# EAGLE schematic controller_v6 (EAGLE 7.1.0)

## Sheet 1 of 4
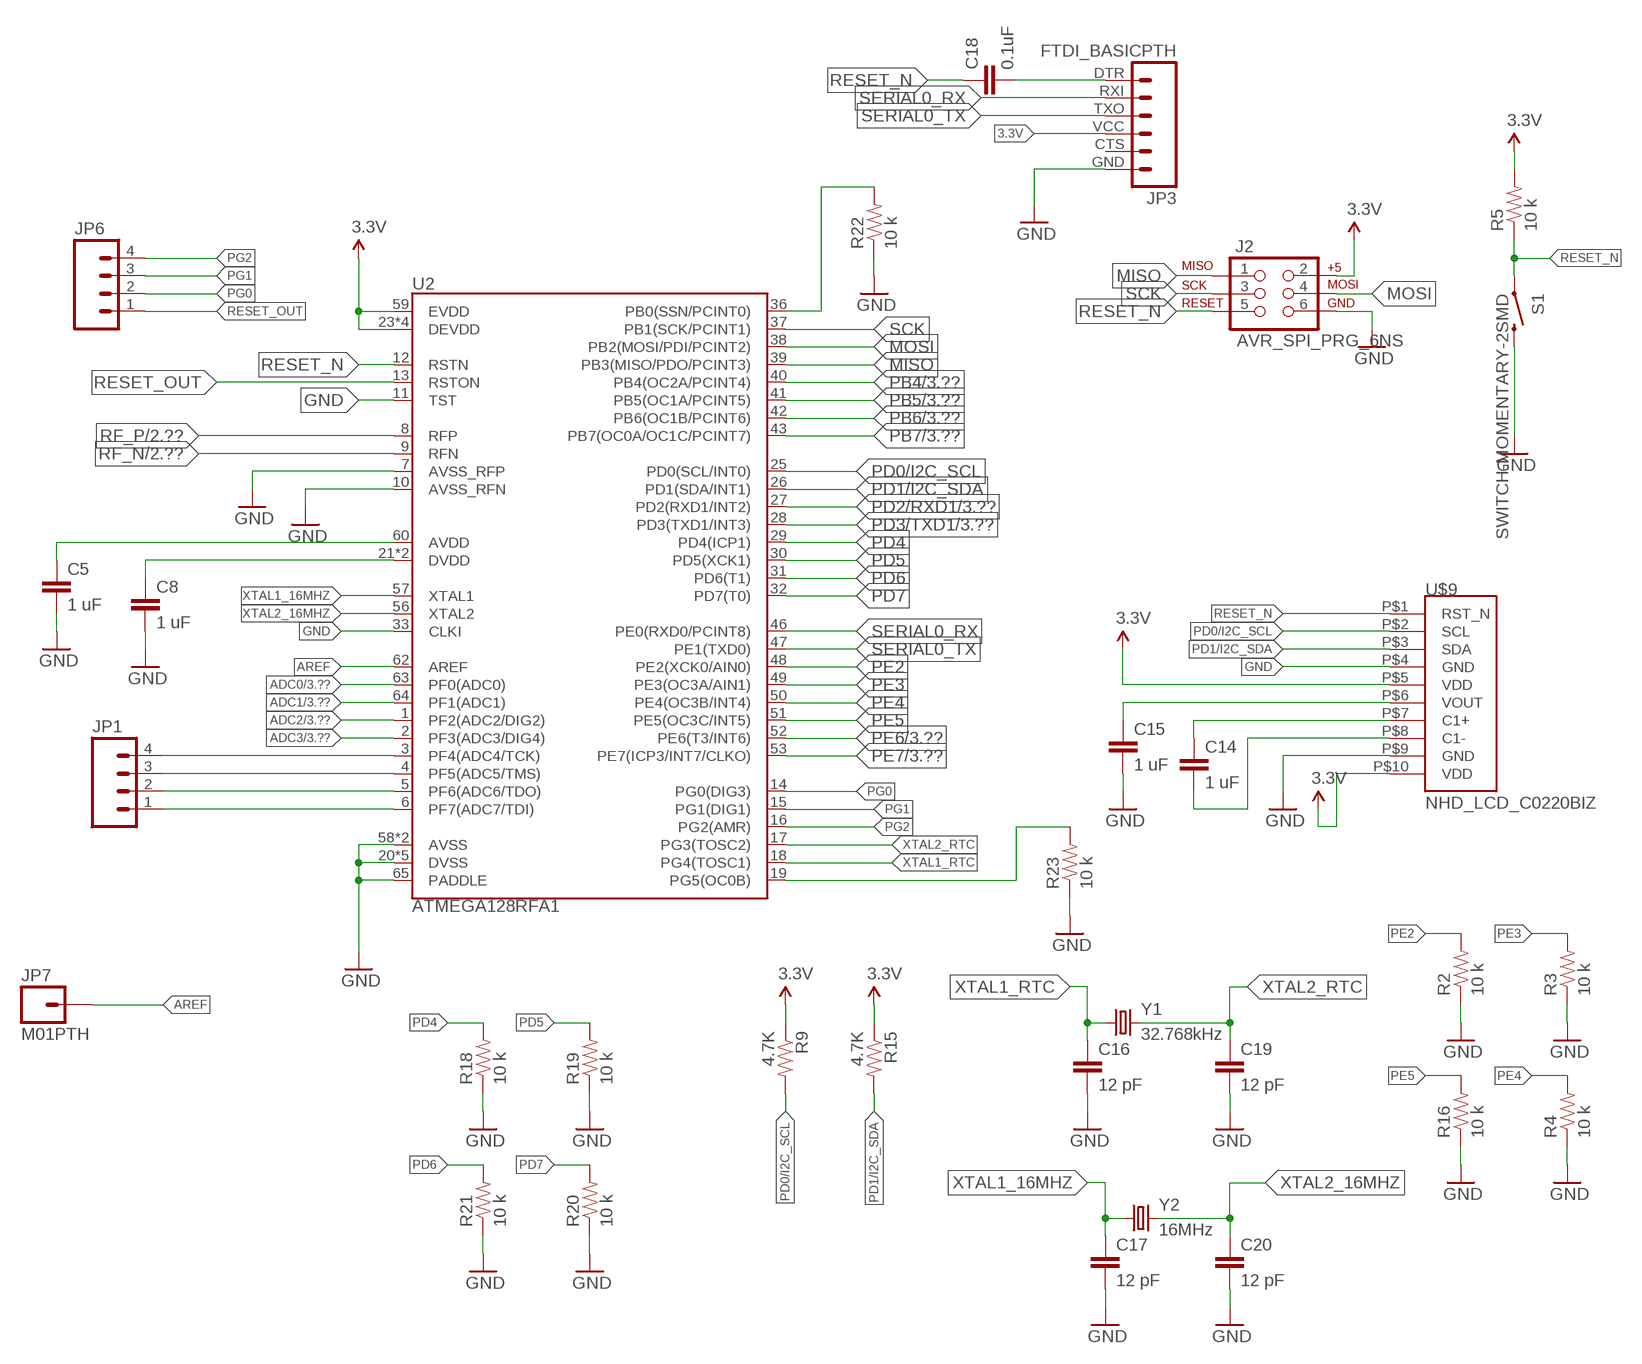
[diagram p0: schematic, sheet 1]

### Parts
C5  1 uF  CAP0805  [0805]
C8  1 uF  CAP0805  [0805]
C14  1 uF  CAP0805  [0805]
C15  1 uF  CAP0805  [0805]
C16  12 pF  CAP0805  [0805]
C17  12 pF  CAP0805  [0805]
C18  0.1uF  CAP0805  [0805]
C19  12 pF  CAP0805  [0805]
C20  12 pF  CAP0805  [0805]
J2  AVR_SPI_PRG_6NS  [2X3-NS]
JP1  M04PTH  [1X04]
JP3  FTDI_BASICPTH  [FTDI_BASIC]
JP6  M04PTH  [1X04]
JP7  M01PTH  [1X01]
R2  10 k  RESISTOR0805-RES  [0805]
R3  10 k  RESISTOR0805-RES  [0805]
R4  10 k  RESISTOR0805-RES  [0805]
R5  10 k  RESISTOR0805-RES  [0805]
R9  4.7K  RESISTOR0805-RES  [0805]
R15  4.7K  RESISTOR0805-RES  [0805]
R16  10 k  RESISTOR0805-RES  [0805]
R18  10 k  RESISTOR0805-RES  [0805]
R19  10 k  RESISTOR0805-RES  [0805]
R20  10 k  RESISTOR0805-RES  [0805]
R21  10 k  RESISTOR0805-RES  [0805]
R22  10 k  RESISTOR0805-RES  [0805]
R23  10 k  RESISTOR0805-RES  [0805]
S1  SWITCH-MOMENTARY-2SMD  [TACTILE_SWITCH_SMD]
U2  ATMEGA128RFA1  [QFN-64]
U$9  NHD_LCD_C0220BIZ  [1X08-2MMPTH-LCD]
Y1  32.768kHz  CRYSTAL32-SMD  [CRYSTAL-32KHZ-SMD]
Y2  16MHz  CRYSTAL5X3  [CRYSTAL-SMD-5X3]

### Nets
3.3V: J2.2 JP3.VCC R5.2 R9.1 R15.1 U2.23(DEVDD) U2.34(DEVDD) U2.44(DEVDD) U2.54(DEVDD) U2.59(EVDD) U$9.P$5(VDD) U$9.P$10(VDD) ; also sheet 3,4
ADC0: U2.63(PF0(ADC0)) ; also sheet 3
ADC1: U2.64(PF1(ADC1)) ; also sheet 3
ADC2: U2.1(PF2(ADC2/DIG2)) ; also sheet 3
ADC3: U2.2(PF3(ADC3/DIG4)) ; also sheet 3
ADC4: JP1.4 U2.3(PF4(ADC4/TCK))
ADC5: JP1.3 U2.4(PF5(ADC5/TMS))
ADC6: JP1.2 U2.5(PF6(ADC6/TDO))
ADC7: JP1.1 U2.6(PF7(ADC7/TDI))
AREF: JP7.1 U2.62(AREF)
GND: C5.2 C8.2 C15.2 C16.2 C17.2 C19.2 C20.2 J2.6 JP3.GND R2.1 R3.1 R4.1 R16.1 R18.1 R19.1 R20.1 R21.1 R22.1 R23.1 S1.3 U2.7(AVSS_RFP) U2.10(AVSS_RFN) U2.11(TST) U2.20(DVSS) U2.24(DVSS) U2.33(CLKI) U2.35(DVSS) U2.45(DVSS) U2.55(DVSS) U2.58(AVSS) U2.61(AVSS) U2.65(PADDLE) U$9.P$4(GND) U$9.P$9(GND) ; also sheet 2,3,4
MISO: J2.1 U2.39(PB3(MISO/PDO/PCINT3))
MOSI: J2.4 U2.38(PB2(MOSI/PDI/PCINT2))
N$2: C18.2 JP3.DTR
N$5: C14.1 U$9.P$7(C1+)
N$15: C5.1 U2.60(AVDD)
N$16: C8.1 U2.21(DVDD) U2.22(DVDD)
N$22: C14.2 U$9.P$8(C1-)
PB0: R22.2 U2.36(PB0(SSN/PCINT0))
PB1: R23.2 U2.19(PG5(OC0B))
PB4: U2.40(PB4(OC2A/PCINT4)) ; also sheet 3
PB5: U2.41(PB5(OC1A/PCINT5)) ; also sheet 3
PB6: U2.42(PB6(OC1B/PCINT6)) ; also sheet 3
PB7: U2.43(PB7(OC0A/OC1C/PCINT7)) ; also sheet 3
PD0/I2C_SCL: R9.2 U2.25(PD0(SCL/INT0)) U$9.P$2(SCL)
PD1/I2C_SDA: R15.2 U2.26(PD1(SDA/INT1)) U$9.P$3(SDA)
PD2/RXD1: U2.27(PD2(RXD1/INT2)) ; also sheet 3
PD3/TXD1: U2.28(PD3(TXD1/INT3)) ; also sheet 3
PD4: R18.2 U2.29(PD4(ICP1))
PD5: R19.2 U2.30(PD5(XCK1))
PD6: R21.2 U2.31(PD6(T1))
PD7: R20.2 U2.32(PD7(T0))
PE2: R2.2 U2.48(PE2(XCK0/AIN0))
PE3: R3.2 U2.49(PE3(OC3A/AIN1))
PE4: R4.2 U2.50(PE4(OC3B/INT4))
PE5: R16.2 U2.51(PE5(OC3C/INT5))
PE6: U2.52(PE6(T3/INT6)) ; also sheet 3
PE7: U2.53(PE7(ICP3/INT7/CLKO)) ; also sheet 3
PG0: JP6.2 U2.14(PG0(DIG3))
PG1: JP6.3 U2.15(PG1(DIG1))
PG2: JP6.4 U2.16(PG2(AMR))
RESET_N: C18.1 J2.5 R5.1 S1.1 U2.12(RSTN) U$9.P$1(RST_N)
RESET_OUT: JP6.1 U2.13(RSTON)
RF_N: U2.9(RFN) ; also sheet 2
RF_P: U2.8(RFP) ; also sheet 2
SCK: J2.3 U2.37(PB1(SCK/PCINT1))
SERIAL0_RX: JP3.RXI U2.46(PE0(RXD0/PCINT8))
SERIAL0_TX: JP3.TXO U2.47(PE1(TXD0))
VOUT: C15.1 U$9.P$6(VOUT)
XTAL1_16MHZ: C17.1 U2.57(XTAL1) Y2.1
XTAL1_RTC: C16.1 U2.18(PG4(TOSC1)) Y1.X1
XTAL2_16MHZ: C20.1 U2.56(XTAL2) Y2.3
XTAL2_RTC: C19.1 U2.17(PG3(TOSC2)) Y1.X2
Unconnected: JP3.CTS

## Sheet 2 of 4
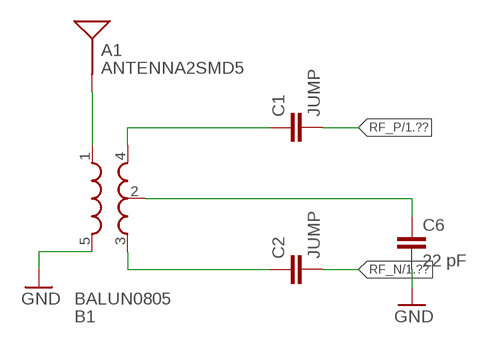
[diagram p1: schematic, sheet 2]

### Parts
A1  ANTENNA2SMD5  [ANTENNA-CHIP5]
B1  BALUN0805  [BALUN]
C1  JUMP  CAP0805  [0805]
C2  JUMP  CAP0805  [0805]
C6  22 pF  CAP0805  [0805]

### Nets
GND: B1.5(GND) C6.2 ; also sheet 1,3,4
N$9: B1.4(OUT1) C1.1
N$10: B1.3(OUT2) C2.1
N$11: B1.2(GND) C6.1
N$12: A1.FEED(SIGNAL) B1.1(IN)
RF_N: C2.2 ; also sheet 1
RF_P: C1.2 ; also sheet 1

## Sheet 3 of 4
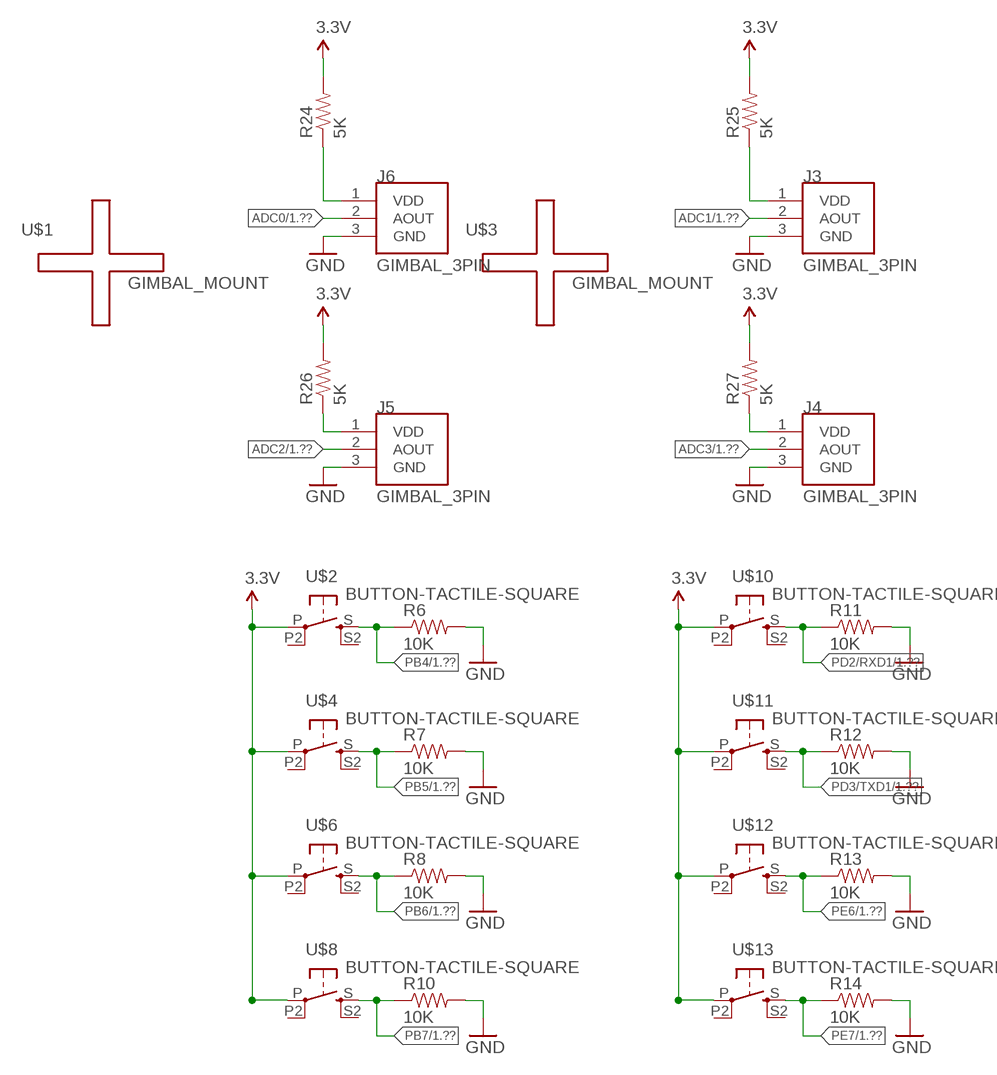
[diagram p2: schematic, sheet 3]

### Parts
J3  GIMBAL_3PIN  [JST-3-PTH]
J4  GIMBAL_3PIN  [JST-3-PTH]
J5  GIMBAL_3PIN  [JST-3-PTH]
J6  GIMBAL_3PIN  [JST-3-PTH]
R6  10K  RESISTOR0805-RES  [0805]
R7  10K  RESISTOR0805-RES  [0805]
R8  10K  RESISTOR0805-RES  [0805]
R10  10K  RESISTOR0805-RES  [0805]
R11  10K  RESISTOR0805-RES  [0805]
R12  10K  RESISTOR0805-RES  [0805]
R13  10K  RESISTOR0805-RES  [0805]
R14  10K  RESISTOR0805-RES  [0805]
R24  5K  RESISTOR0805-RES  [0805]
R25  5K  RESISTOR0805-RES  [0805]
R26  5K  RESISTOR0805-RES  [0805]
R27  5K  RESISTOR0805-RES  [0805]
U$1  GIMBAL_MOUNT  [GIMBAL_FOOTPRINT]
U$2  BUTTON-TACTILE-SQUARE  [BUTTON-TACTILE-SQUARE-ADAFRUIT1010]
U$3  GIMBAL_MOUNT  [GIMBAL_FOOTPRINT]
U$4  BUTTON-TACTILE-SQUARE  [BUTTON-TACTILE-SQUARE-ADAFRUIT1010]
U$6  BUTTON-TACTILE-SQUARE  [BUTTON-TACTILE-SQUARE-ADAFRUIT1010]
U$8  BUTTON-TACTILE-SQUARE  [BUTTON-TACTILE-SQUARE-ADAFRUIT1010]
U$10  BUTTON-TACTILE-SQUARE  [BUTTON-TACTILE-SQUARE-ADAFRUIT1010]
U$11  BUTTON-TACTILE-SQUARE  [BUTTON-TACTILE-SQUARE-ADAFRUIT1010]
U$12  BUTTON-TACTILE-SQUARE  [BUTTON-TACTILE-SQUARE-ADAFRUIT1010]
U$13  BUTTON-TACTILE-SQUARE  [BUTTON-TACTILE-SQUARE-ADAFRUIT1010]

### Nets
3.3V: R24.2 R25.2 R26.2 R27.2 U$2.P U$4.P U$6.P U$8.P U$10.P U$11.P U$12.P U$13.P ; also sheet 1,4
ADC0: J6.2(AOUT) ; also sheet 1
ADC1: J3.2(AOUT) ; also sheet 1
ADC2: J5.2(AOUT) ; also sheet 1
ADC3: J4.2(AOUT) ; also sheet 1
GND: J3.3(GND) J4.3(GND) J5.3(GND) J6.3(GND) R6.2 R7.2 R8.2 R10.2 R11.2 R12.2 R13.2 R14.2 ; also sheet 1,2,4
N$1: J6.1(VDD) R24.1
N$3: J3.1(VDD) R25.1
N$4: J5.1(VDD) R26.1
N$6: J4.1(VDD) R27.1
PB4: R6.1 U$2.S ; also sheet 1
PB5: R7.1 U$4.S ; also sheet 1
PB6: R8.1 U$6.S ; also sheet 1
PB7: R10.1 U$8.S ; also sheet 1
PD2/RXD1: R11.1 U$10.S ; also sheet 1
PD3/TXD1: R12.1 U$11.S ; also sheet 1
PE6: R13.1 U$12.S ; also sheet 1
PE7: R14.1 U$13.S ; also sheet 1
Unconnected: U$2.P2(P1) U$2.S2(S1) U$4.P2(P1) U$4.S2(S1) U$6.P2(P1) U$6.S2(S1) U$8.P2(P1) U$8.S2(S1) U$10.P2(P1) U$10.S2(S1) U$11.P2(P1) U$11.S2(S1) U$12.P2(P1) U$12.S2(S1) U$13.P2(P1) U$13.S2(S1)

## Sheet 4 of 4
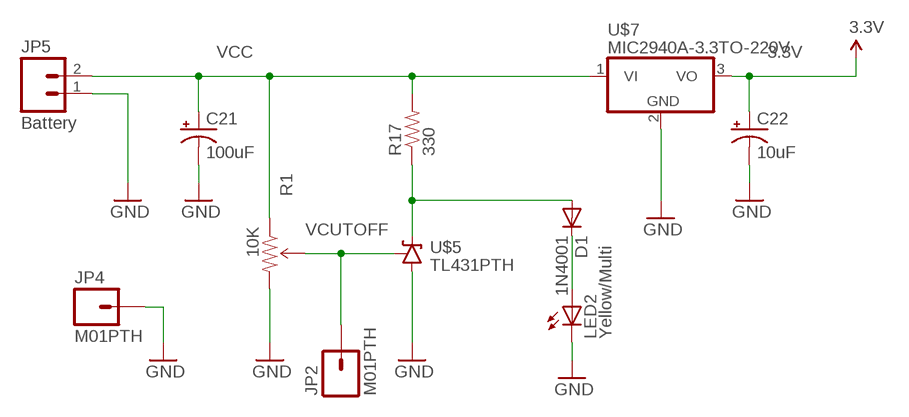
[diagram p3: schematic, sheet 4]

### Parts
C21  100uF  CPOL-USE3.5-8  [E3,5-8]
C22  10uF  CPOL-USE2.5-5  [E2,5-5]
D1  1N4001  1N4004  [DO41-10]
JP2  M01PTH  [1X01]
JP4  M01PTH  [1X01]
JP5  Battery  M02PTH  [1X02]
LED2  Yellow/Multi  LED5MM  [LED5MM]
R1  10K  TRIMPOT-PTH-KNOB  [3386U]
R17  330  RESISTORAXIAL-0.3  [AXIAL-0.3]
U$5  TL431PTH  [TO-92]
U$7  MIC2940A-3.3TO-220V  [TO-220V]

### Nets
3.3V: C22.+ U$7.3(VO) ; also sheet 1,3
GND: C21.- C22.- JP4.1 JP5.1 LED2.K(C) R1.3(CW) U$5.2(A) U$7.2(GND) ; also sheet 1,2,3
N$20: D1.A R17.P$1 U$5.3(C)
N$21: D1.C LED2.A
VCC: C21.+ JP5.2 R1.1(CCW) R17.P$2 U$7.1(VI)
VCUTOFF: JP2.1 R1.2(WIPER) U$5.1(R)

## Library data of the parts
A1 = Controller:ANTENNA2: Chip antenna Single endded antenna. Common with smaller chip antennas. CHIP4 package is the GPS Chip Antenna SKU: GPS-08418. CHIP5 package is 2.4GHz chip antenna SKU: WRL-00144.
B1 = Controller:BALUN: 0805 footprint balun- Ember 351/357
C1 C2 C5 C6 C8 C14-C20 = Controller:CAP: Capacitor Standard 0603 ceramic capacitor, and 0.1" leaded capacitor.
C21 C22 = rcl:CPOL-US: POLARIZED CAPACITOR, American symbol
D1 = diode:1N4004: DIODE general purpose rectifier, 1 A
J2 = Controller:AVR_SPI_PRG_6: AVR ISP 6 Pin This is the reduced ISP connector for AVR programming. Common on Arduino. This footprint will take up less PCB space and can be used with a 10-pin to 6-pin adapter such as SKU: BOB-08508
J3-J6 = Controller:GIMBAL_3PIN: This is the surface mount connector for the 9XR Replacement Gimbal. It uses a 3 Pin, 2 mm Pitch, JST connector (https://www.sparkfun.com/products/9750) You can see the analog transmitter here: http://www.hobbyking.com/hobbyking/store/__39505__Transmitter_Gimbal_Set_Left_Turnigy_9XR_Transmitter_Mode_1.html The black wire is VDD, the White wire is Ground, the Red wire is Analog Out Author: Dustin Richmond Created: 10/25/2014
JP1 JP6 = Controller:M04: Header 4 Standard 4-pin 0.1" header. Use with straight break away headers (SKU : PRT-00116), right angle break away headers (PRT-00553), swiss pins (PRT-00743), machine pins (PRT-00117), and female headers (PRT-00115). Molex polarized connector foot print use with SKU : PRT-08231 with associated crimp pins and housings. 1MM SMD Version SKU: PRT-10208
JP2 JP4 = SparkFun:M01: Header 1 Standard 1-pin 0.1" header. Use with straight break away headers (SKU : PRT-00116), right angle break away headers (PRT-00553), swiss pins (PRT-00743), machine pins (PRT-00117), and female headers (PRT-00115).
JP3 = Controller:FTDI_BASIC: FTDI Basic header with labels
JP5 = SparkFun:M02: Header 2 Standard 2-pin 0.1" header. Use with straight break away headers (SKU : PRT-00116), right angle break away headers (PRT-00553), swiss pins (PRT-00743), machine pins (PRT-00117), and female headers (PRT-00115). Molex polarized connector foot print use with SKU : PRT-08233 with associated crimp pins and housings.
JP7 = Controller:M01: Header 1 Standard 1-pin 0.1" header. Use with straight break away headers (SKU : PRT-00116), right angle break away headers (PRT-00553), swiss pins (PRT-00743), machine pins (PRT-00117), and female headers (PRT-00115).
LED2 = SparkFun:LED: LEDs Standard schematic elements and footprints for 5mm, 3mm, 1206, and 0603 sized LEDs. 5mm - Spark Fun Electronics SKU : COM-00529 (and others)
R1 = Controller:TRIMPOT; CREATOR: Brandon; REVIEWER1: Chris
R2-R16 R18-R27 = Controller:RESISTOR: Resistor Basic schematic elements and footprints for 0603, 1206, and PTH resistors.
R17 = SparkFun:RESISTOR: Resistor Basic schematic elements and footprints for 0603, 1206, and PTH resistors.
S1 = Controller:SWITCH-MOMENTARY-2: Various NO switches- pushbuttons, reed, etc
U2 = Controller:ATMEGA128RFA1: ATmega128RFA1 8-bit AVR Microcontroller with Low Power 2.4GHz Transceiver for ZigBee and IEEE 802.15.4
U$1 U$3 = Controller:GIMBAL_MOUNT
U$2 U$4 U$6 U$8 U$10-U$13 = Controller:BUTTON-TACTILE
U$5 = SparkFun:TL431
U$7 = SparkFun:MIC2940A-3.3: MIC2940A-3.3 Voltage Regulator 3.3V mic2940.pdf
U$9 = Controller:NHD_LCD_C0220BIZ: This is the device for the NHD‐C0220BiZ‐FSW‐FBW‐3V3M COG (Chip‐On‐Glass) Character Liquid Crystal Display Module. Datasheet: http://www.newhavendisplay.com/specs/NHD-C0220BiZ-FSW-FBW-3V3M.pdf Author: Dustin Richmond Created: 10/25/2014
Y1 Y2 = Controller:CRYSTAL: Various standard crystals. Proven footprints. Spark Fun Electronics SKU : COM-00534